# Altium schematic sheet RF1110demoDB.SchDoc
size A4
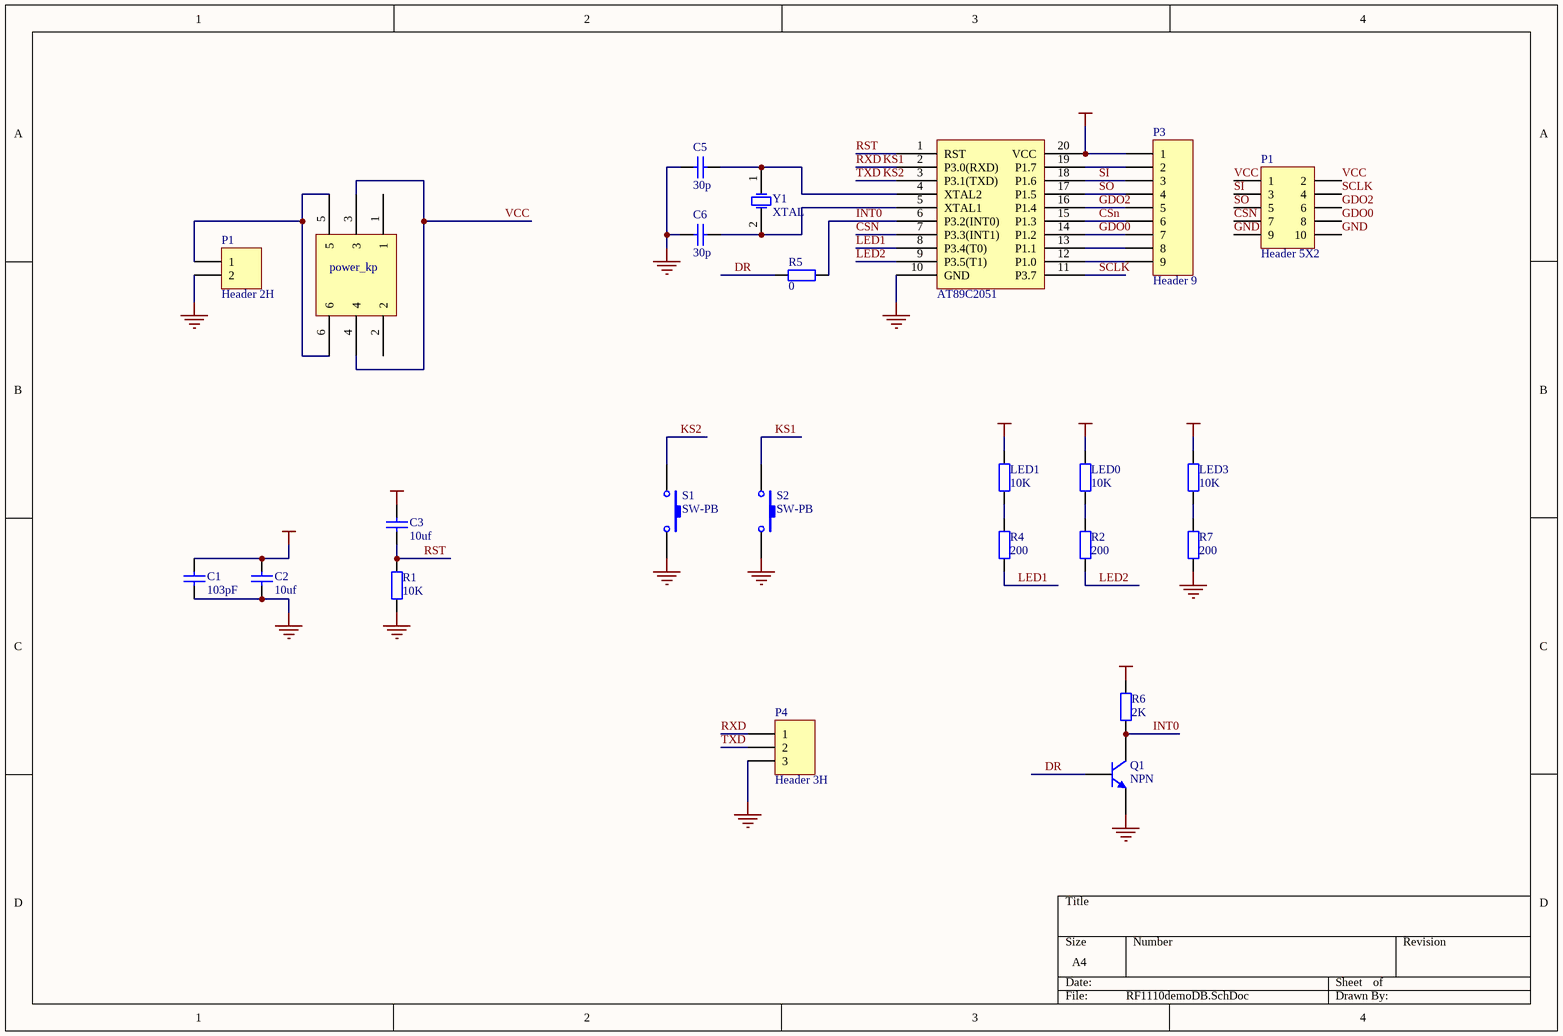
[diagram p0: RF1110demoDB.SchDoc]

## Parts
(Parts that share a designator on the sheet are numbered #1, #2 ... from top to bottom, then left to right.)
AT89C2051  51  [CDIP20]  (value not drawn)
C1  value 103pF  [C1608-0603]  (hidden comment: Cap)
C2  value 10uf  [CC3216-1206]  (hidden comment: Cap)
C3  value 10uf  [R2012-0805]  (hidden comment: Cap)
C5  value 30p  [C1608-0603]  (hidden comment: Cap)
C6  value 30p  [C1608-0603]  (hidden comment: Cap)
LED0  value 10K  [LED_3]  (hidden comment: Res2)
LED1  value 10K  [LED_3]  (hidden comment: Res2)
LED3  value 10K  [LED_3]  (hidden comment: Res2)
P1#1  Header 5X2  [HDR2X5]
P1#2  Header 2H  [HDR1X2H]
P3  Header 9  [HDR1X9]
P4  Header 3H  [HDR1X3H]
power_kp  key3  [S_2]  (value not drawn)
Q1  NPN  [SOT23]
R1  value 10K  [C1608-0603]  (hidden comment: Res2)
R2  value 200  [C1608-0603]  (hidden comment: Res2)
R4  value 200  [C1608-0603]  (hidden comment: Res2)
R5  value 0  [C1608-0603]  (hidden comment: Res2)
R6  value 2K  [C1608-0603]  (hidden comment: Res2)
R7  value 200  [C1608-0603]  (hidden comment: Res2)
S1  SW-PB  [PCBComponent_1]
S2  SW-PB  [PCBComponent_1]
Y1  XTAL  [CRYSTAL]

## Nets
GND: AT89C2051.10(GND) C1.2 C2.1 C5.1 C6.1 P1#1.9 P1#1.10 P1#2.2 P4.3 Q1.2(E) R1.1 R7.1 S1.2 S2.2
VCC: AT89C2051.20(VCC) C1.1 C2.2 C3.2 LED0.2 LED1.2 LED3.2 P1#1.1 P1#1.2 P3.1 power_kp.3 power_kp.4 R6.1
CSN: AT89C2051.7(P3.3(INT1)) AT89C2051.15(P1.3) P1#1.7 P3.6
DR: Q1.1(B) R5.2
GDO0: AT89C2051.14(P1.2) P1#1.8 P3.7
GDO2: AT89C2051.16(P1.4) P1#1.6 P3.5
INT0: AT89C2051.6(P3.2(INT0)) Q1.3(C) R5.1 R6.2
KS1: AT89C2051.2(P3.0(RXD)) P4.1 S2.1  [also labelled RXD]
KS2: AT89C2051.3(P3.1(TXD)) P4.2 S1.1  [also labelled TXD]
LED1: AT89C2051.8(P3.4(T0)) R4.1
LED2: AT89C2051.9(P3.5(T1)) R2.1
RST: AT89C2051.1(RST) C3.1 R1.2
SCLK: AT89C2051.11(P3.7) P1#1.4
SI: AT89C2051.18(P1.6) P1#1.3 P3.3
SO: AT89C2051.17(P1.5) P1#1.5 P3.4
NetAT89C2051_4: AT89C2051.4(XTAL2) C5.2 Y1.1(OSC1)
NetAT89C2051_5: AT89C2051.5(XTAL1) C6.2 Y1.2(OSC2)
NetAT89C2051_12: AT89C2051.12(P1.0) P3.9
NetAT89C2051_13: AT89C2051.13(P1.1) P3.8
NetAT89C2051_19: AT89C2051.19(P1.7) P3.2
NetLED0_1: LED0.1 R2.2
NetLED1_1: LED1.1 R4.2
NetLED3_1: LED3.1 R7.2
NetP1#2_1: P1#2.1 power_kp.5 power_kp.6

Not connected (* = marked no-connect by the designer): power_kp 1 2

## Library data of the parts
AT89C2051 = at89c2051
C1-C3 C5 C6 = Cap: Capacitor; Published: 8-Jun-2000; LatestRevisionDate: 17-Jul-2002; LatestRevisionNote: Re-released for DXP Platform.; Publisher: Altium Limited
LED0 LED1 LED3 R1 R2 R4-R7 = Res2: Resistor; Published: 8-Jun-2000; LatestRevisionDate: 17-Jul-2002; LatestRevisionNote: Re-released for DXP Platform.; Publisher: Altium Limited
P1#1 = Header 5X2: Header, 5-Pin, Dual row; LatestRevisionDate: 17-Jul-2002; LatestRevisionNote: Re-released for DXP Platform.; Publisher: Altium Limited
P1#2 = Header 2H: Header, 2-Pin, Right Angle; LatestRevisionDate: 17-Jul-2002; LatestRevisionNote: Re-released for DXP Platform.; Publisher: Altium Limited
P3 = Header 9: Header, 9-Pin; LatestRevisionDate: 17-Jul-2002; LatestRevisionNote: Re-released for DXP Platform.; Publisher: Altium Limited
P4 = Header 3H: Header, 3-Pin, Right Angle; LatestRevisionDate: 17-Jul-2002; LatestRevisionNote: Re-released for DXP Platform.; Publisher: Altium Limited
Q1 = NPN: NPN Bipolar Transistor; Published: 8-Jun-2000; LatestRevisionDate: 17-Jul-2002; LatestRevisionNote: Re-released for DXP Platform.; Publisher: Altium Limited; Code_JEDEC: TO-226-AA
S1 S2 = SW-PB: Switch; Published: 24-Mar-1999; LatestRevisionDate: 17-Jul-2002; LatestRevisionNote: Re-released for DXP Platform.; Publisher: Altium Limited
Y1 = XTAL: Crystal Oscillator; Published: 8-Jun-2000; LatestRevisionDate: 17-Jul-2002; LatestRevisionNote: Re-released for DXP Platform.; Publisher: Altium Limited